# Altium project HAB-Main-Flight-Computer-Card-Template.PrjPcb (part 3 of 4)

## Sheet ComputeModule.SchDoc: Main Flight Computer Processor
size A2; Organization: Brickworks; Address1: Matthew Glazer; Address2: Design Engineer; Revision: 1A; SheetNumber: 5; SheetTotal: 7
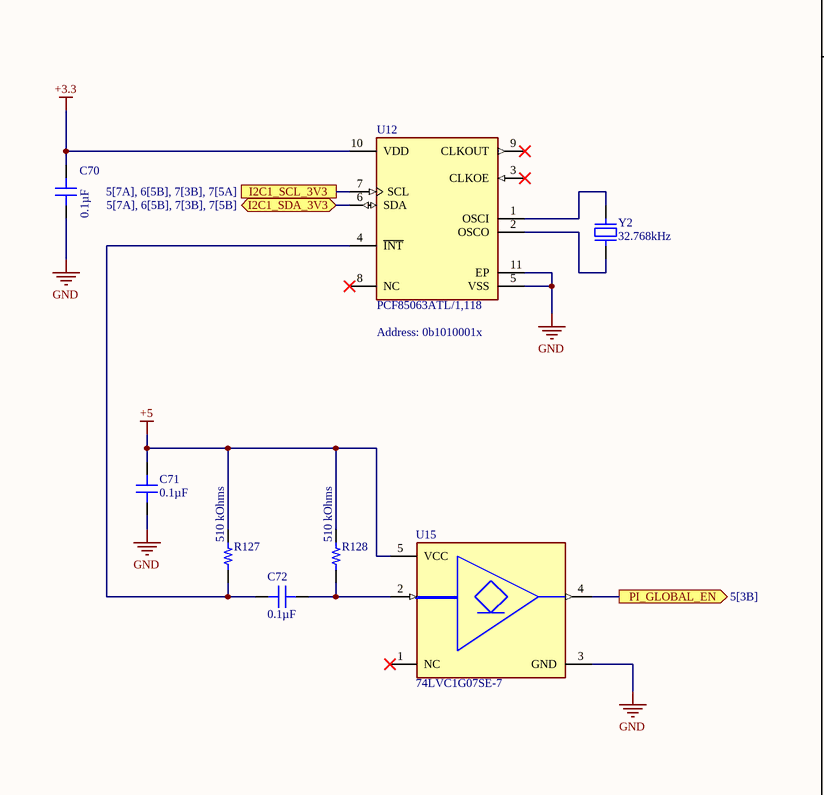
[diagram p5: ComputeModule.SchDoc, left]
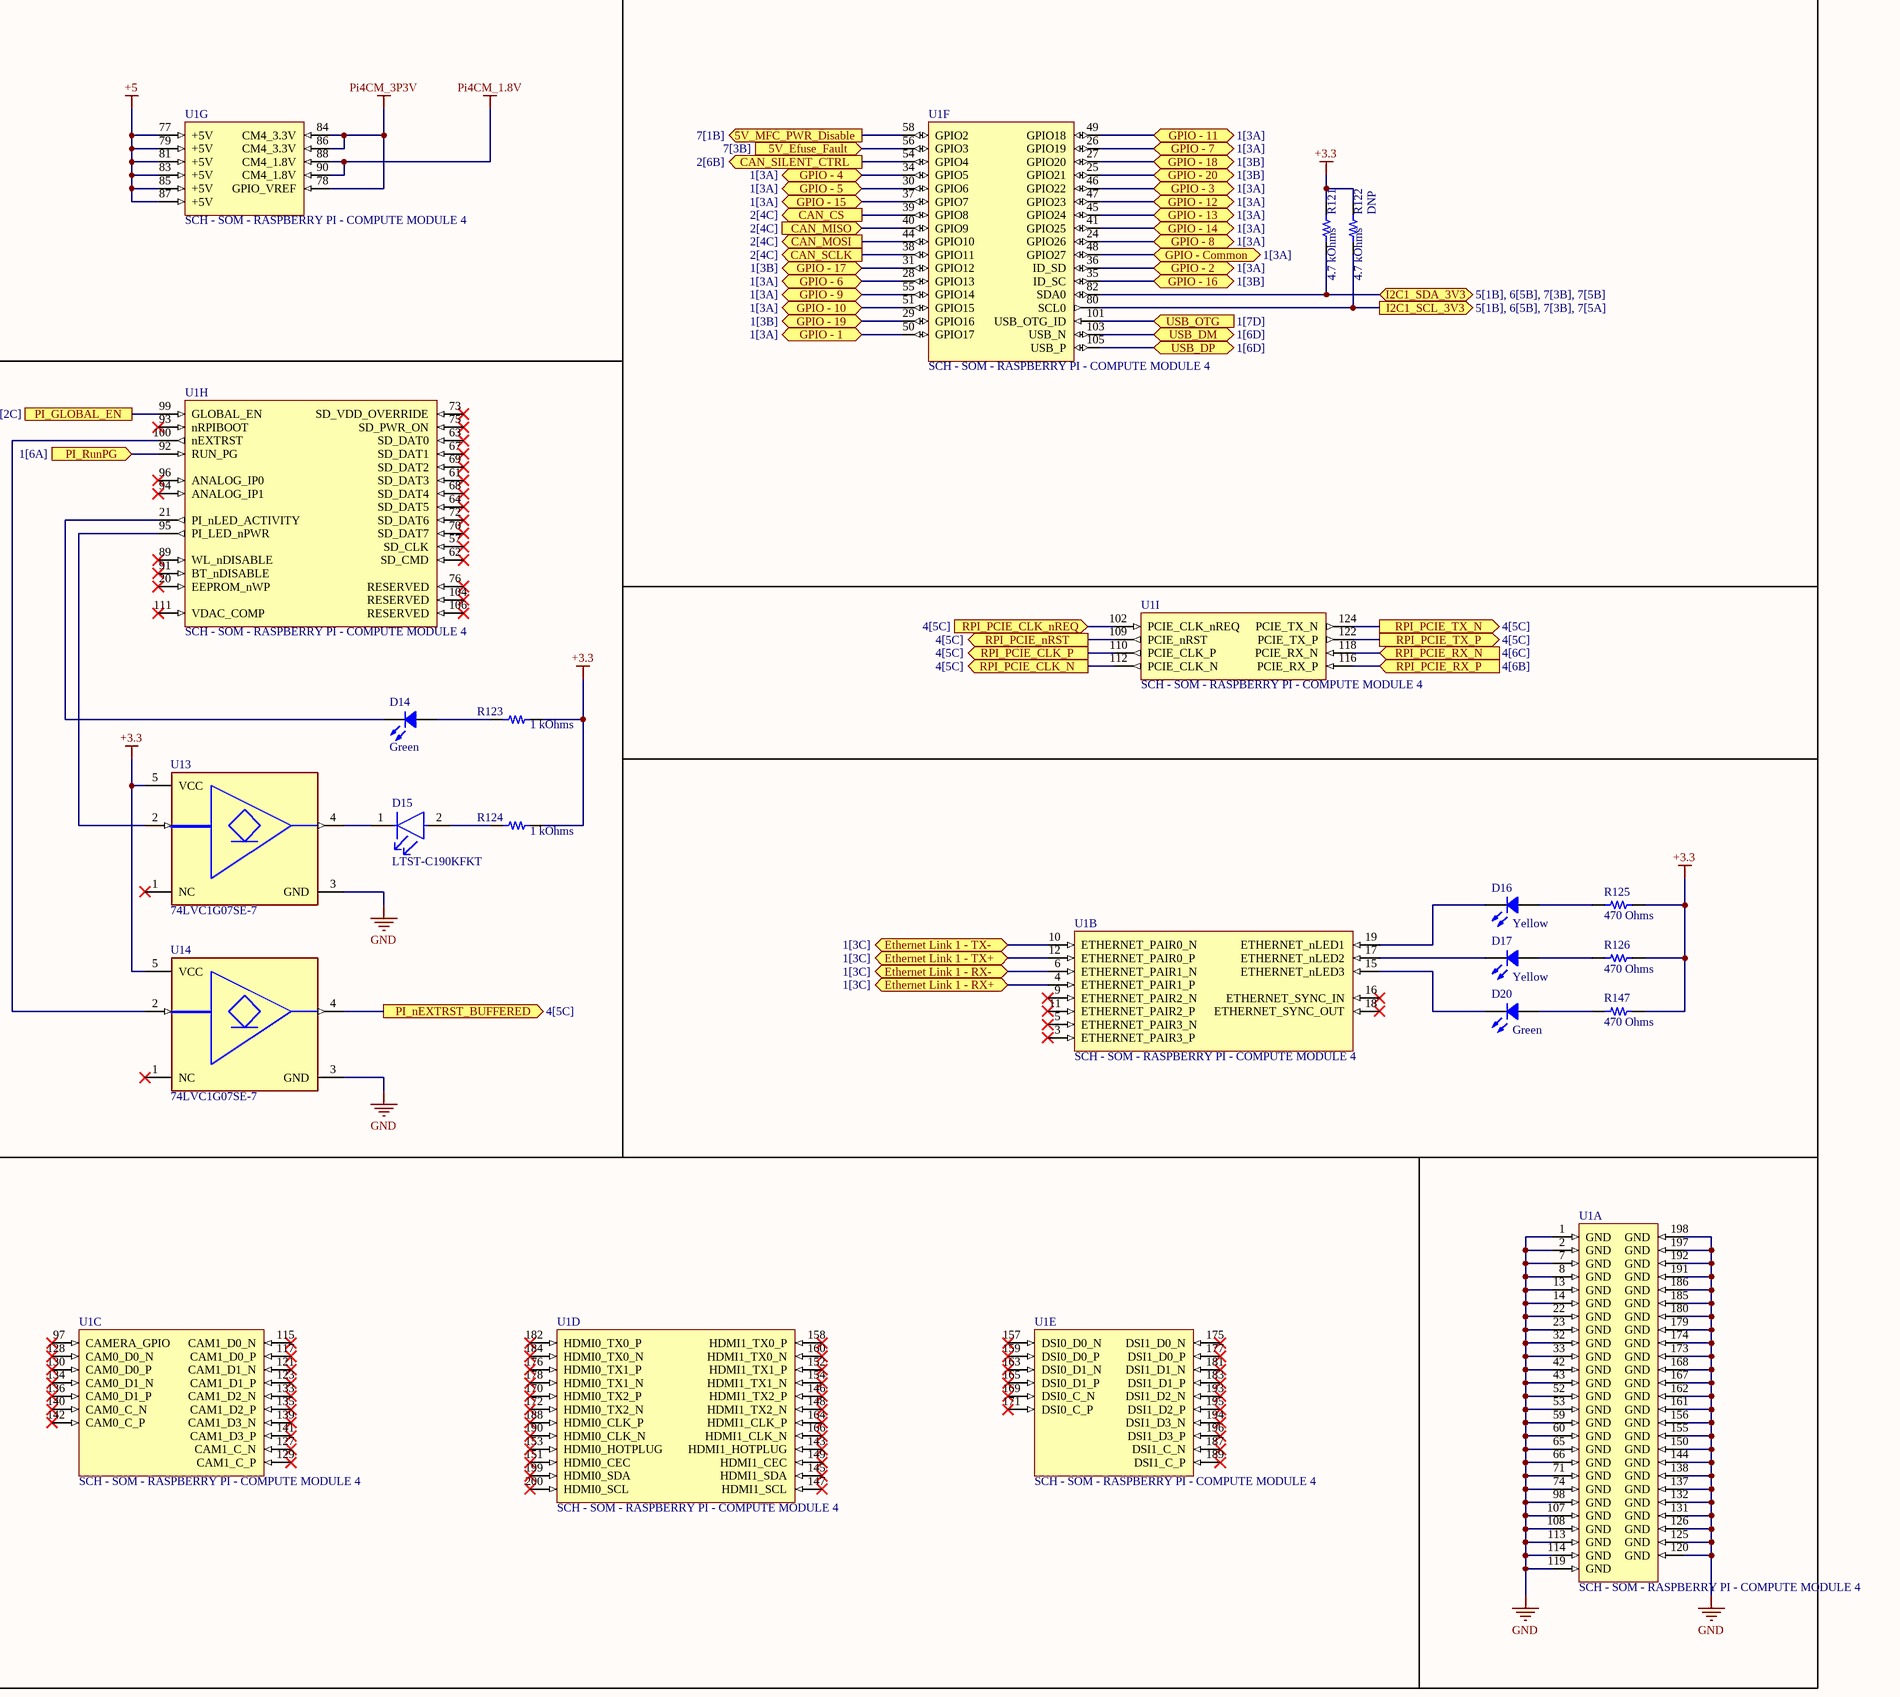
[diagram p6: ComputeModule.SchDoc, right]

### Parts
C70  0.1µF  [CAP 0603_1608]
C71  0.1µF  [CAP 0603_1608]
C72  0.1µF  [CAP 0603_1608]
D14  Green  [LED 0603_1608 GREEN]
D15  LTST-C190KFKT  [FP-LTST-C190KFKT-MFG]
D16  Yellow  [LED 0603_1608 YELLOW]
D17  Yellow  [LED 0603_1608 YELLOW]
D20  Green  [LED 0603_1608 GREEN]
R121  4.7 kOhms  [RES 0603_1608]
R122  4.7 kOhms  [RES 0603_1608]
R123  1 kOhms  [RES 0603_1608]
R124  1 kOhms  [RES 0603_1608]
R125  470 Ohms  [RES 0603_1608]
R126  470 Ohms  [RES 0603_1608]
R127  510 kOhms  [RES 0603_1608]
R128  510 kOhms  [RES 0603_1608]
R147  470 Ohms  [RES 0603_1608]
U1  SCH - SOM - RASPBERRY PI - COMPUTE MODULE 4  [PCB - SOM - Pi4 Compute Module]  (parts A,B,C,D,E,F,G,H,I of 9)
U12  PCF85063ATL/1,118  [FP-SOT1197-1-MFG]
U13  74LVC1G07SE-7  [FP-SOT353-MFG]
U14  74LVC1G07SE-7  [FP-SOT353-MFG]
U15  74LVC1G07SE-7  [FP-SOT353-MFG]
Y2  32.768kHz  [ABRACON ABS07]

### Ports
5V_Efuse_Fault (in, see 7[3B]), 5V_MFC_PWR_Disable (out, see 7[1B]), CAN_CS (out, see 2[4C]), CAN_MISO (in, see 2[4C]), CAN_MOSI (out, see 2[4C]), CAN_SCLK (out, see 2[4C]), CAN_SILENT_CTRL (out, see 2[6B]), Ethernet Link 1 - RX+ (bidir, see 1[3C]), Ethernet Link 1 - RX- (bidir, see 1[3C]), Ethernet Link 1 - TX+ (bidir, see 1[3C]), Ethernet Link 1 - TX- (bidir, see 1[3C]), GPIO - 1 (bidir, see 1[3A]), GPIO - 2 (bidir, see 1[3A]), GPIO - 3 (bidir, see 1[3A]), GPIO - 4 (bidir, see 1[3A]), GPIO - 5 (bidir, see 1[3A]), GPIO - 6 (bidir, see 1[3A]), GPIO - 7 (bidir, see 1[3A]), GPIO - 8 (bidir, see 1[3A]), GPIO - 9 (bidir, see 1[3A]), GPIO - 10 (bidir, see 1[3A]), GPIO - 11 (bidir, see 1[3A]), GPIO - 12 (bidir, see 1[3A]), GPIO - 13 (bidir, see 1[3A]), GPIO - 14 (bidir, see 1[3A]), GPIO - 15 (bidir, see 1[3A]), GPIO - 16 (bidir, see 1[3B]), GPIO - 17 (bidir, see 1[3B]), GPIO - 18 (bidir, see 1[3B]), GPIO - 19 (bidir, see 1[3B]), GPIO - 20 (bidir, see 1[3B]), GPIO - Common (bidir, see 1[3A]), I2C1_SCL_3V3 (out, see 5[1B], 6[5B], 7[3B], 7[5A]), I2C1_SCL_3V3 (see 5[7A], 6[5B], 7[3B], 7[5A]), I2C1_SDA_3V3 (bidir, see 5[1B], 6[5B], 7[3B], 7[5B]), I2C1_SDA_3V3 (bidir, see 5[7A], 6[5B], 7[3B], 7[5B]), PI_GLOBAL_EN (out, see 5[3B]), PI_GLOBAL_EN (see 5[2C]), PI_nEXTRST_BUFFERED (out, see 4[5C]), PI_RunPG (in, see 1[6A]), RPI_PCIE_CLK_N (out, see 4[5C]), RPI_PCIE_CLK_nREQ (in, see 4[5C]), RPI_PCIE_CLK_P (out, see 4[5C]), RPI_PCIE_nRST (out, see 4[5C]), RPI_PCIE_RX_N (in, see 4[6C]), RPI_PCIE_RX_P (in, see 4[6B]), RPI_PCIE_TX_N (out, see 4[5C]), RPI_PCIE_TX_P (out, see 4[5C]), USB_DM (bidir, see 1[6D]), USB_DP (bidir, see 1[6D]), USB_OTG (in, see 1[7D])

### Nets
+3.3: C70.2 R121.2 R122.2 R123.1 R124.1 R125.2 R126.2 R147.2 U12.10(VDD) U13.5(VCC) U14.5(VCC)
+5: C71.1 R127.2 R128.2 U1.77(+5V) U1.79(+5V) U1.81(+5V) U1.83(+5V) U1.85(+5V) U1.87(+5V) U15.5(VCC)
GND: C70.1 C71.2 U1.1(GND) U1.2(GND) U1.7(GND) U1.8(GND) U1.13(GND) U1.14(GND) U1.22(GND) U1.23(GND) U1.32(GND) U1.33(GND) U1.42(GND) U1.43(GND) U1.52(GND) U1.53(GND) U1.59(GND) U1.60(GND) U1.65(GND) U1.66(GND) U1.71(GND) U1.74(GND) U1.98(GND) U1.107(GND) U1.108(GND) U1.113(GND) U1.114(GND) U1.119(GND) U1.120(GND) U1.125(GND) U1.126(GND) U1.131(GND) U1.132(GND) U1.137(GND) U1.138(GND) U1.144(GND) U1.150(GND) U1.155(GND) U1.156(GND) U1.161(GND) U1.162(GND) U1.167(GND) U1.168(GND) U1.173(GND) U1.174(GND) U1.179(GND) U1.180(GND) U1.185(GND) U1.186(GND) U1.191(GND) U1.192(GND) U1.197(GND) U1.198(GND) U12.5(VSS) U12.11(EP) U13.3(GND) U14.3(GND) U15.3(GND)
Pi4CM_1.8V: U1.88(CM4_1.8V) U1.90(CM4_1.8V)
Pi4CM_3P3V: U1.78(GPIO_VREF) U1.84(CM4_3.3V) U1.86(CM4_3.3V)
ETH1_RX_N: U1.6(ETHERNET_PAIR1_N) ; port Ethernet Link 1 - RX-
ETH1_RX_P: U1.4(ETHERNET_PAIR1_P) ; port Ethernet Link 1 - RX+
ETH1_TX_N: U1.10(ETHERNET_PAIR0_N) ; port Ethernet Link 1 - TX-
ETH1_TX_P: U1.12(ETHERNET_PAIR0_P) ; port Ethernet Link 1 - TX+
NetC5_1: U1.116(PCIE_RX_P) ; port RPI_PCIE_RX_P
NetC6_1: U1.118(PCIE_RX_N) ; port RPI_PCIE_RX_N
NetC72_1: C72.1 R128.1 U15.2(A)
NetC72_2: C72.2 R127.1 U12.4(~{INT})
NetD14_1: D14.1 R123.2
NetD14_2: D14.2 U1.21(PI_nLED_ACTIVITY)
NetD15_1: D15.1(C) U13.4(Y)
NetD15_2: D15.2(A) R124.2
NetD16_1: D16.1 R125.1
NetD16_2: D16.2 U1.19(ETHERNET_nLED1)
NetD17_1: D17.1 R126.1
NetD17_2: D17.2 U1.17(ETHERNET_nLED2)
NetD20_1: D20.1 R147.1
NetD20_2: D20.2 U1.15(ETHERNET_nLED3)
NetJ1_13: U1.48(GPIO27) ; port GPIO - Common
NetJ1_14: U1.50(GPIO17) ; port GPIO - 1
NetJ1_15: U1.36(ID_SD) ; port GPIO - 2
NetJ1_16: U1.46(GPIO22) ; port GPIO - 3
NetJ1_17: U1.30(GPIO6) ; port GPIO - 5
NetJ1_18: U1.34(GPIO5) ; port GPIO - 4
NetJ1_19: U1.26(GPIO19) ; port GPIO - 7
NetJ1_20: U1.28(GPIO13) ; port GPIO - 6
NetJ1_21: U1.55(GPIO14) ; port GPIO - 9
NetJ1_22: U1.24(GPIO26) ; port GPIO - 8
NetJ1_23: U1.49(GPIO18) ; port GPIO - 11
NetJ1_24: U1.51(GPIO15) ; port GPIO - 10
NetJ1_25: U1.45(GPIO24) ; port GPIO - 13
NetJ1_26: U1.47(GPIO23) ; port GPIO - 12
NetJ1_27: U1.37(GPIO7) ; port GPIO - 15
NetJ1_28: U1.41(GPIO25) ; port GPIO - 14
NetJ1_29: U1.31(GPIO12) ; port GPIO - 17
NetJ1_30: U1.35(ID_SC) ; port GPIO - 16
NetJ1_31: U1.27(GPIO20) ; port GPIO - 18
NetJ1_32: U1.29(GPIO16) ; port GPIO - 19
NetJ1_33: U1.25(GPIO21) ; port GPIO - 20
NetJ3_1: U1.92(RUN_PG) ; port PI_RunPG
NetR44_1: U1.101(USB_OTG_ID) ; port USB_OTG
NetR48_2: U1.54(GPIO4) ; port CAN_SILENT_CTRL
NetR95_1: U1.56(GPIO3) ; port 5V_Efuse_Fault
NetR106_2: U1.58(GPIO2) ; port 5V_MFC_PWR_Disable
NetR121_1: R121.1 U1.82(SDA0) U12.6(SDA) ; port I2C1_SDA_3V3
NetR122_1: R122.1 U1.80(SCL0) U12.7(SCL) ; port I2C1_SCL_3V3
NetR135_1: U14.4(Y) ; port PI_nEXTRST_BUFFERED
NetU1_38: U1.38(GPIO11) ; port CAN_SCLK
NetU1_39: U1.39(GPIO8) ; port CAN_CS
NetU1_40: U1.40(GPIO9) ; port CAN_MISO
NetU1_44: U1.44(GPIO10) ; port CAN_MOSI
NetU1_95: U1.95(PI_LED_nPWR) U13.2(A)
NetU1_99: U1.99(GLOBAL_EN) U15.4(Y) ; port PI_GLOBAL_EN
NetU1_100: U1.100(nEXTRST) U14.2(A)
NetU1_102: U1.102(PCIE_CLK_nREQ) ; port RPI_PCIE_CLK_nREQ
NetU1_103: U1.103(USB_N) ; port USB_DM
NetU1_105: U1.105(USB_P) ; port USB_DP
NetU1_109: U1.109(PCIE_nRST) ; port RPI_PCIE_nRST
NetU1_110: U1.110(PCIE_CLK_P) ; port RPI_PCIE_CLK_P
NetU1_112: U1.112(PCIE_CLK_N) ; port RPI_PCIE_CLK_N
NetU1_122: U1.122(PCIE_TX_P) ; port RPI_PCIE_TX_P
NetU1_124: U1.124(PCIE_TX_N) ; port RPI_PCIE_TX_N
NetU12_1: U12.1(OSCI) Y2.2
NetU12_2: U12.2(OSCO) Y2.1

Not connected (* = marked no-connect by the designer): U1 3(ETHERNET_PAIR3_P)* 5(ETHERNET_PAIR3_N)* 9(ETHERNET_PAIR2_N)* 11(ETHERNET_PAIR2_P)* 16(ETHERNET_SYNC_IN)* 18(ETHERNET_SYNC_OUT)* 20(EEPROM_nWP)* 57(SD_CLK)* 61(SD_DAT3)* 62(SD_CMD)* 63(SD_DAT0)* 64(SD_DAT5)* 67(SD_DAT1)* 68(SD_DAT4)* 69(SD_DAT2)* 70(SD_DAT7)* 72(SD_DAT6)* 73(SD_VDD_OVERRIDE)* 75(SD_PWR_ON)* 76(RESERVED)* 89(WL_nDISABLE)* 91(BT_nDISABLE)* 93(nRPIBOOT)* 94(ANALOG_IP1)* 96(ANALOG_IP0)* 97(CAMERA_GPIO)* 104(RESERVED)* 106(RESERVED)* 111(VDAC_COMP)* 115(CAM1_D0_N)* 117(CAM1_D0_P)* 121(CAM1_D1_N)* 123(CAM1_D1_P)* 127(CAM1_C_N)* 128(CAM0_D0_N)* 129(CAM1_C_P)* 130(CAM0_D0_P)* 133(CAM1_D2_N)* 134(CAM0_D1_N)* 135(CAM1_D2_P)* 136(CAM0_D1_P)* 139(CAM1_D3_N)* 140(CAM0_C_N)* 141(CAM1_D3_P)* 142(CAM0_C_P)* 143(HDMI1_HOTPLUG)* 145(HDMI1_SDA)* 146(HDMI1_TX2_P)* 147(HDMI1_SCL)* 148(HDMI1_TX2_N)* 149(HDMI1_CEC)* 151(HDMI0_CEC)* 152(HDMI1_TX1_P)* 153(HDMI0_HOTPLUG)* 154(HDMI1_TX1_N)* 157(DSI0_D0_N)* 158(HDMI1_TX0_P)* 159(DSI0_D0_P)* 160(HDMI1_TX0_N)* 163(DSI0_D1_N)* 164(HDMI1_CLK_P)* 165(DSI0_D1_P)* 166(HDMI1_CLK_N)* 169(DSI0_C_N)* 170(HDMI0_TX2_P)* 171(DSI0_C_P)* 172(HDMI0_TX2_N)* 175(DSI1_D0_N)* 176(HDMI0_TX1_P)* 177(DSI1_D0_P)* 178(HDMI0_TX1_N)* 181(DSI1_D1_N)* 182(HDMI0_TX0_P)* 183(DSI1_D1_P)* 184(HDMI0_TX0_N)* 187(DSI1_C_N)* 188(HDMI0_CLK_P)* 189(DSI1_C_P)* 190(HDMI0_CLK_N)* 193(DSI1_D2_N)* 194(DSI1_D3_N)* 195(DSI1_D2_P)* 196(DSI1_D3_P)* 199(HDMI0_SDA)* 200(HDMI0_SCL)*; U12 3(CLKOE)* 8(NC)* 9(CLKOUT)*; U13 1(NC)*; U14 1(NC)*; U15 1(NC)*

### Notes on the sheet
- (near R122) DNP
- (near U12) Address: 0b1010001x
- Title
- Size:
- Date:
- File:
- A2
- Number:
- Time:
- Revision:
- Sheet
- of

### Library data of the parts
C70-C72 = CL10B104KA8WPNC: CAP CER 0.1UF 25V X7R 0603; Manufacturer: Samsung Electro-Mechanics; Tolerance: ±10%; Part Number: CL10B104KA8WPNC; Value: 0.1µF; Applications: Automotive; Capacitance: 0.1µF; ComponentLink1Description: Datasheet; ComponentLink1URL: http://www.samsungsem.com/kr/support/product-search/mlcc/CL10B104KA8WPNC.jsp; ComponentLink2Description: DigiKey Link; ComponentLink2URL: http://digikey.com/product-detail/en/samsung-electro-mechanics/CL10B104KA8WPNC/1276-6717-1-ND/5961576; Device Package: 0603 (1608 Metric); Features: Open Mode; LastUpdated: 9/2/2020 1:03:30 AM; Lifecycle Status: Active; Minimum Order: 1; Mounting Type: Surface Mount, MLCC; Operating Temperature: -55°C ~ 125°C; Package / Case: 0603 (1608 Metric); Packaging: TapeAndReel; PartId: 5631; Part Status: Active; Price: 0.02; Ratings: AEC-Q200; Series: CL; Size / Dimension: 0.063" L x 0.031" W (1.60mm x 0.80mm); Supplier 1: DigiKey; Supplier Part Number 1: 1276-6717-1-ND; Temperature Coefficient: X7R; Thickness (Max): 0.035" (0.90mm); Voltage - Rated: 25V
D14 D20 = LTST-C193KGKT-5A: LED GREEN CLEAR CHIP SMD; Manufacturer: Lite-On Inc.; Configuration: Standard; Current - Test: 5mA; Lens Color: Colorless; Lens Size: 1.15mm x 0.80mm; Lens Style: Rectangle with Flat Top; Millicandela Rating: 16.25mcd; Viewing Angle: 130°; Voltage - Forward (Vf) (Typ): 2V; Wavelength - Dominant: 572nm; Wavelength - Peak: 574nm; Part Number: LTST-C193KGKT-5A; Color: Green; ComponentLink1Description: Datasheet; ComponentLink1URL: http://optoelectronics.liteon.com/upload/download/DS22-2007-0094/LTST-C193KGKT-5A.PDF; ComponentLink2Description: DigiKey Link; ComponentLink2URL: http://digikey.com/product-detail/en/lite-on-inc/LTST-C193KGKT-5A/160-1828-1-ND/2356247; Device Package: 0603 (1608 Metric); Height (Max): 0.45mm; LastUpdated: 9/2/2020 1:20:41 AM; Lens Transparency: Clear; Lifecycle Status: Active; Minimum Order: 1; Mounting Type: Surface Mount; Package / Case: 0603 (1608 Metric); Packaging: TapeAndReel; PartId: 694; Part Status: Active; Price: 0.06; Series: -; Size / Dimension: 1.60mm L x 0.80mm W; Supplier 1: DigiKey; Supplier Part Number 1: 160-1828-1-ND; Supplier Device Package: Chip LED; Value: Green
D15 = CMP-1674-00008-2: LED ORANGE CLEAR CHIP SMD; Number of LEDs: 1; Reverse Voltage: 5V; Power Rating: 75mW; Lens Style: Diffused; Wavelength: 611nm; Forward Voltage: 2V; Test Current: 20mA; Lens Color: Colorless; Dominant Wavelength: 605nm; Forward Current: 30mA; Viewing Angle: 130°; Luminous Intensity: 90mcd; Depth: 1.6mm; Length: 3.2mm; Width: 0.8mm; Lead Free: Lead Free; Height: 0.8mm; Radiation Hardening: No; Max Operating Temperature: 85°C; Illumination Color: Orange; Power Dissipation: 75mW; Packaging: Tape and Reel; Lens Transparency: Clear; Min Operating Temperature: -55°C; Package Quantity: 1; Case Code (Metric): 1608; Number of Pins: 2; Case Code (Imperial): 0603; Case/Package: 0603; Number of Elements: 1; Color: Orange; Mount: Surface Mount
D16 D17 = LTST-C191KSKT: LED YELLOW CLEAR SMD; Manufacturer: Lite-On Inc.; Configuration: Standard; Current - Test: 20mA; Lens Color: Colorless; Lens Size: 1.10mm x 0.80mm; Lens Style: Rectangle with Flat Top; Millicandela Rating: 104mcd; Viewing Angle: 130°; Voltage - Forward (Vf) (Typ): 2.1V; Wavelength - Dominant: 591nm; Wavelength - Peak: 588nm; Part Number: LTST-C191KSKT; Color: Yellow; ComponentLink1Description: Datasheet; ComponentLink1URL: http://optoelectronics.liteon.com/upload/download/DS22-2000-224/LTST-C191KSKT.PDF; ComponentLink2Description: DigiKey Link; ComponentLink2URL: http://digikey.com/product-detail/en/lite-on-inc/LTST-C191KSKT/160-1448-1-ND/386838; Device Package: 0603 (1608 Metric); Height (Max): 0.65mm; LastUpdated: 9/2/2020 1:21:17 AM; Lens Transparency: Clear; Lifecycle Status: Active; Minimum Order: 1; Mounting Type: Surface Mount; Package / Case: 0603 (1608 Metric); Packaging: TapeAndReel; PartId: 132; Part Status: Active; Price: 0.04; Series: -; Size / Dimension: 1.60mm L x 0.80mm W; Supplier 1: DigiKey; Supplier Part Number 1: 160-1448-1-ND; Value: Yellow
R121 R122 = RMCF0603FT4K70: RES 4.7K OHM 1% 1/10W 0603; Manufacturer: Stackpole Electronics Inc; Power (Watts): 0.1W, 1/10W; Temperature Coefficient: ±100ppm/°C; Part Number: RMCF0603FT4K70; Value: 4.7 kOhms; ComponentLink1Description: Datasheet; ComponentLink1URL: https://www.seielect.com/catalog/sei-rmcf_rmcp.pdf; ComponentLink2Description: DigiKey Link; ComponentLink2URL: http://digikey.com/product-detail/en/stackpole-electronics-inc/RMCF0603FT4K70/RMCF0603FT4K70CT-ND/1943033; Composition: Thick Film; Device Package: 0603 (1608 Metric); Features: Automotive AEC-Q200; Height - Seated (Max): 0.022" (0.55mm); LastUpdated: 9/2/2020 1:10:22 AM; Lifecycle Status: Active; Minimum Order: 1; Number of Terminations: 2; Operating Temperature: -55°C ~ 155°C; Package / Case: 0603 (1608 Metric); Packaging: CutTape; PartId: 6078; Part Status: Active; Price: 0.10; Ratings: AEC-Q200; Resistance: 4.7 kOhms; Series: RMCF; Size / Dimension: 0.061" L x 0.031" W (1.55mm x 0.80mm); Supplier 1: DigiKey; Supplier Part Number 1: RMCF0603FT4K70CT-ND; Supplier Device Package: 0603; Tolerance: ±1%
R123 R124 = RNCP0603FTD1K00: RES 1K OHM 1% 1/8W 0603; Manufacturer: Stackpole Electronics Inc; Power (Watts): 0.125W, 1/8W; Temperature Coefficient: ±100ppm/°C; Part Number: RNCP0603FTD1K00; Value: 1 kOhms; ComponentLink1Description: Datasheet; ComponentLink1URL: https://www.seielect.com/catalog/sei-rncp.pdf; ComponentLink2Description: DigiKey Link; ComponentLink2URL: http://digikey.com/product-detail/en/stackpole-electronics-inc/RNCP0603FTD1K00/RNCP0603FTD1K00CT-ND/2240445; Composition: Thin Film; Device Package: 0603 (1608 Metric); Features: Anti-Sulfur, Moisture Resistant; Height - Seated (Max): 0.020" (0.50mm); LastUpdated: 9/2/2020 1:10:23 AM; Lifecycle Status: Active; Minimum Order: 1; Number of Terminations: 2; Operating Temperature: -55°C ~ 155°C; Package / Case: 0603 (1608 Metric); Packaging: TapeAndReel; PartId: 5694; Part Status: Active; Price: 0.01; Resistance: 1 kOhms; Series: RNCP; Size / Dimension: 0.059" L x 0.031" W (1.50mm x 0.80mm); Supplier 1: DigiKey; Supplier Part Number 1: RNCP0603FTD1K00CT-ND; Supplier Device Package: 0603; Tolerance: ±1%
R125 R126 R147 = RMCF0603JT470R: RES 470 OHM 5% 1/10W 0603; Manufacturer: Stackpole Electronics Inc; Power (Watts): 0.1W, 1/10W; Temperature Coefficient: ±200ppm/°C; Part Number: RMCF0603JT470R; Value: 470 Ohms; ComponentLink1Description: Datasheet; ComponentLink1URL: https://www.seielect.com/catalog/sei-rmcf_rmcp.pdf; ComponentLink2Description: DigiKey Link; ComponentLink2URL: http://digikey.com/product-detail/en/stackpole-electronics-inc/RMCF0603JT470R/RMCF0603JT470RCT-ND/1943166; Composition: Thick Film; Device Package: 0603 (1608 Metric); Features: Automotive AEC-Q200; Height - Seated (Max): 0.022" (0.55mm); LastUpdated: 9/2/2020 1:10:23 AM; Lifecycle Status: Active; Minimum Order: 1; Number of Terminations: 2; Operating Temperature: -55°C ~ 155°C; Package / Case: 0603 (1608 Metric); Packaging: CutTape; PartId: 5857; Part Status: Active; Price: 0.10; Ratings: AEC-Q200; Resistance: 470 Ohms; Series: RMCF; Size / Dimension: 0.061" L x 0.031" W (1.55mm x 0.80mm); Supplier 1: DigiKey; Supplier Part Number 1: RMCF0603JT470RCT-ND; Supplier Device Package: 0603; Tolerance: ±5%
R127 R128 = RMCF0603JT510K: RES 510K OHM 5% 1/10W 0603; Manufacturer: Stackpole Electronics Inc; Power (Watts): 0.1W, 1/10W; Temperature Coefficient: ±200ppm/°C; Part Number: RMCF0603JT510K; Value: 510 kOhms; ComponentLink1Description: Datasheet; ComponentLink1URL: https://www.seielect.com/catalog/sei-rmcf_rmcp.pdf; ComponentLink2Description: DigiKey Link; ComponentLink2URL: http://digikey.com/product-detail/en/stackpole-electronics-inc/RMCF0603JT510K/RMCF0603JT510KCT-ND/6053186; Composition: Thick Film; Device Package: 0603 (1608 Metric); Features: Automotive AEC-Q200; Height - Seated (Max): 0.022" (0.55mm); LastUpdated: 9/2/2020 1:10:01 AM; Lifecycle Status: Active; Minimum Order: 1; Number of Terminations: 2; Operating Temperature: -55°C ~ 155°C; Package / Case: 0603 (1608 Metric); Packaging: CutTape; PartId: 15991; Part Status: Active; Price: 0.10; Ratings: AEC-Q200; Resistance: 510 kOhms; Series: RMCF; Size / Dimension: 0.061" L x 0.031" W (1.55mm x 0.80mm); Supplier 1: DigiKey; Supplier Part Number 1: RMCF0603JT510KCT-ND; Supplier Device Package: 0603; Tolerance: ±5%
U12 = CMP-10083-000009-1: IC RTC CLK/CALENDAR I2C 10-SON; Manufacturer: NXP Semiconductors; Frequency: 0.001/1.024/2.048/4.096/8.192/16.384/32.768kHz; Nominal Supply Current: 18uA; Min Supply Voltage: 0.9V; Number Of Outputs: 1; Standoff Height: 0mm; Max Supply Voltage: 5.5V; RoHS: TRUE; Manufacturer Part Number: PCF85063ATL/1,118; Octopart: https://octopart.com/pcf85063atl%2F1%2C118-nxp+semiconductors-27552710; Device Class L3: Real Time Clocks; Height: 0.5mm; Lead Free: Yes; Ipc Land Pattern Name: DFN260X260X50-10; Temperature Range Low: -40°C; Interface: I2C; ComponentLink2URL: https://www.nxp.com/docs/en/data-sheet/PCF85063A.pdf; Mouser Description: Tiny Real-Time Clock/calendar With Alarm Function And I2C-Bus Rohs Compliant: Yes; Package: SOT1197-1; Category: IC; Ambient Temperature Range Low: -40°C; Temperature: -40°C to +85°C; ComponentLink2Description: Datasheet; Ambient Temperature Range High: +85°C; Automotive: No; Temperature Range High: +85°C; Digikey Description: IC RTC CLK/CALENDAR I2C 10-SON; Device Class L1: Integrated Circuits (ICs); Footprint Url: https://www.nxp.com/docs/en/package-information/SOT1197-1.pdf; Device Class L2: Clock and Timing
U13-U15 = CMP-12739-000001-1: IC BUF NON-INVERT 5.5V SOT353; Manufacturer: Diodes Inc.; Number Of Outputs: 1; Standoff Height: 0mm; Propagation Delay: 1.7ns; Nominal Supply Current: 0.1uA; Min Supply Voltage: 1.65V; Max Junction Temp: +150°C; Logic Function Desc: Non-Inverting; Temperature: -40°C to +125°C; RoHS: TRUE; ComponentLink2Description: Datasheet; Category: IC; Ipc Land Pattern Name: SOT65P210X100-5; Digikey Description: IC BUF NON-INVERT 5.5V SOT353; Device Class L2: Logic ICs; Number Of Inputs: 1; Height: 1.1mm; Ambient Temperature Range High: +125°C; Lead Free: Yes; Octopart: https://octopart.com/74lvc1g07se-7-diodes+inc.-18882698; Device Class L1: Integrated Circuits (ICs); Number Of Circuits: 1; Max Supply Voltage: 5.5V; Temperature Range Low: -40°C; Manufacturer Part Number: 74LVC1G07SE-7; Device Class L3: Buffers; ComponentLink2URL: https://www.diodes.com/assets/Datasheets/74LVC1G07.pdf; Footprint Url: https://www.diodes.com/assets/Package-Files/SOT353.pdf; Temperature Range High: +125°C; Package: SOT353; Mouser Description: 74LVC Series 5.5 V Surface Mount Single Buffer with Open Drain Output - SOT-353; Automotive: No; Ambient Temperature Range Low: -40°C
Y2 = ABS07-166-32.768KHZ-T: IOT 32.786KHZ XTAL; Manufacturer: Abracon LLC; ESR (Equivalent Series Resistance): 70 kOhms; Frequency Tolerance: ±10ppm; Load Capacitance: 7pF; Operating Mode: Fundamental; Part Number: ABS07-166-32.768KHZ-T; ComponentLink1Description: Datasheet; ComponentLink1URL: https://abracon.com/datasheets/ABS07-166-32.768kHz-T.pdf; ComponentLink2Description: DigiKey Link; ComponentLink2URL: http://digikey.com/product-detail/en/abracon-llc/ABS07-166-32.768KHZ-T/535-14514-1-ND/8827205; Frequency: 32.768kHz; Height - Seated (Max): 0.035" (0.90mm); LastUpdated: 9/2/2020 1:21:47 AM; Lifecycle Status: Active; Minimum Order: 1; Mounting Type: Surface Mount; Operating Temperature: -40°C ~ 85°C; Package / Case: 2-SMD, No Lead; Packaging: TapeAndReel; PartId: 384; Part Status: Active; Price: 0.35; Series: ABS07; Size / Dimension: 0.126" L x 0.059" W (3.20mm x 1.50mm); Supplier 1: DigiKey; Supplier Part Number 1: 535-14514-1-ND; Type: kHz Crystal (Tuning Fork); Value: 32.768kHz

## Sheet Sensors.SchDoc: Main Flight Computer Sensors
size A3; Organization: Brickworks; Address1: Matthew Glazer; Address2: Design Engineer; Revision: 1A; SheetNumber: 6; SheetTotal: 7
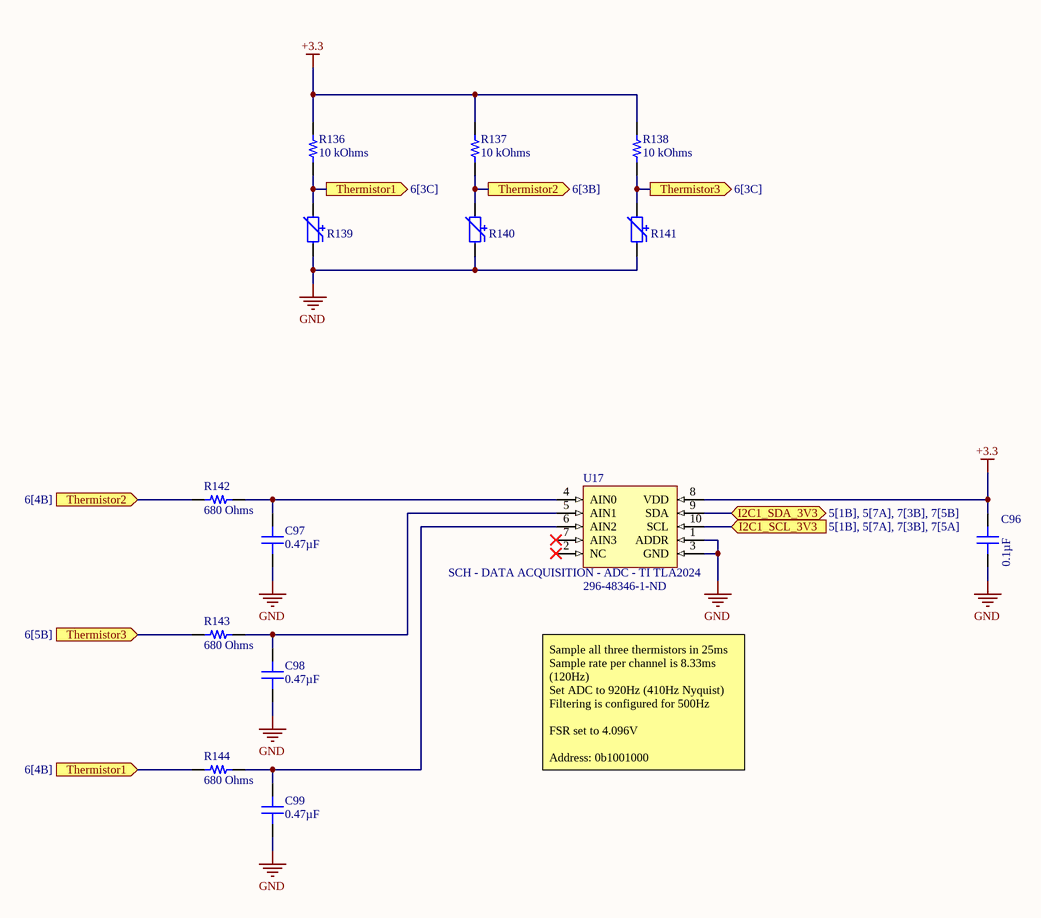
[diagram p7: Sensors.SchDoc]

### Parts
C96  0.1µF  [CAP 0603_1608]
C97  0.47µF  [CAP 0603_1608]
C98  0.47µF  [CAP 0603_1608]
C99  0.47µF  [CAP 0603_1608]
R136  10 kOhms  [RES 0603_1608]
R137  10 kOhms  [RES 0603_1608]
R138  10 kOhms  [RES 0603_1608]
R139  10 kOhms  [PTC 0402_1005]  (value not drawn)
R140  10 kOhms  [PTC 0402_1005]  (value not drawn)
R141  10 kOhms  [PTC 0402_1005]  (value not drawn)
R142  680 Ohms  [RES 0603_1608]
R143  680 Ohms  [RES 0603_1608]
R144  680 Ohms  [RES 0603_1608]
U17  SCH - DATA ACQUISITION - ADC - TI TLA2024  Supplier Part Number 1: 296-48346-1-ND  [PCB - LEADLESS - QFN - TI X2QFN-10]

### Ports
I2C1_SCL_3V3 (in, see 5[1B], 5[7A], 7[3B], 7[5A]), I2C1_SDA_3V3 (bidir, see 5[1B], 5[7A], 7[3B], 7[5B]), Thermistor1 (in, see 6[4B]), Thermistor1 (out, see 6[3C]), Thermistor2 (in, see 6[4B]), Thermistor2 (out, see 6[3B]), Thermistor3 (in, see 6[5B]), Thermistor3 (out, see 6[3C])

### Nets
+3.3: C96.2 R136.2 R137.2 R138.2 U17.8(VDD)
GND: C96.1 C97.1 C98.1 C99.1 R139.1 R140.1 R141.1 U17.1(ADDR) U17.3(GND)
NetC97_2: C97.2 R142.2 U17.4(AIN0)
NetC98_2: C98.2 R143.2 U17.5(AIN1)
NetC99_2: C99.2 R144.2 U17.6(AIN2)
NetR121_1: U17.9(SDA) ; port I2C1_SDA_3V3
NetR122_1: U17.10(SCL) ; port I2C1_SCL_3V3
NetR136_1: R136.1 R139.2 R144.1 ; port Thermistor1
NetR137_1: R137.1 R140.2 R142.1 ; port Thermistor2
NetR138_1: R138.1 R141.2 R143.1 ; port Thermistor3

Not connected (* = marked no-connect by the designer): U17 2(NC)* 7(AIN3)*

### Notes on the sheet
- Sample all three thermistors in 25ms
  Sample rate per channel is 8.33ms (120Hz)
  Set ADC to 920Hz (410Hz Nyquist)
  Filtering is configured for 500Hz
  FSR set to 4.096V
  Address: 0b1001000
- Title
- Size:
- Date:
- A3
- Number:
- Time:
- Revision:
- Sheet
- of
- File:

### Library data of the parts
C96 = CL10B104KA8WPNC: as C70 on sheet ComputeModule; Part Number: CL10B104KA8WPNC; Value: 0.1µF; Applications: Automotive; Capacitance: 0.1µF; ComponentLink1Description: Datasheet; ComponentLink1URL: http://www.samsungsem.com/kr/support/product-search/mlcc/CL10B104KA8WPNC.jsp; ComponentLink2Description: DigiKey Link; ComponentLink2URL: http://digikey.com/product-detail/en/samsung-electro-mechanics/CL10B104KA8WPNC/1276-6717-1-ND/5961576; Device Package: 0603 (1608 Metric); Features: Open Mode; LastUpdated: 9/2/2020 1:03:30 AM; Lifecycle Status: Active; Minimum Order: 1; Mounting Type: Surface Mount, MLCC; Operating Temperature: -55°C ~ 125°C; Package / Case: 0603 (1608 Metric); Packaging: TapeAndReel; PartId: 5631; Part Status: Active; Price: 0.02; Ratings: AEC-Q200; Series: CL; Size / Dimension: 0.063" L x 0.031" W (1.60mm x 0.80mm); Supplier 1: DigiKey; Supplier Part Number 1: 1276-6717-1-ND; Temperature Coefficient: X7R; Thickness (Max): 0.035" (0.90mm); Voltage - Rated: 25V
C97-C99 = C0603C474K4PACTU: CAP CER 0.47UF 16V X5R 0603; Manufacturer: KEMET; Tolerance: ±10%; Part Number: C0603C474K4PACTU; Value: 0.47µF; Applications: General Purpose; Capacitance: 0.47µF; ComponentLink1Description: Datasheet; ComponentLink1URL: https://api.kemet.com/component-edge/download/datasheet/C0603C474K4PACTU.pdf; ComponentLink2Description: DigiKey Link; ComponentLink2URL: http://digikey.com/product-detail/en/kemet/C0603C474K4PACTU/399-7934-1-ND/3471657; Device Package: 0603 (1608 Metric); LastUpdated: 9/2/2020 1:03:36 AM; Lifecycle Status: Active; Minimum Order: 1; Mounting Type: Surface Mount, MLCC; Operating Temperature: -55°C ~ 85°C; Package / Case: 0603 (1608 Metric); Packaging: TapeAndReel; PartId: 2292; Part Status: Active; Price: 0.02; Series: SMD Comm X5R; Size / Dimension: 0.063" L x 0.031" W (1.60mm x 0.80mm); Supplier 1: DigiKey; Supplier Part Number 1: 399-7934-1-ND; Temperature Coefficient: X5R; Thickness (Max): 0.034" (0.87mm); Voltage - Rated: 16V
R136-R138 = RMCF0603FT10K0: RES 10K OHM 1% 1/10W 0603; Manufacturer: Stackpole Electronics Inc; Power (Watts): 0.1W, 1/10W; Temperature Coefficient: ±100ppm/°C; Part Number: RMCF0603FT10K0; Value: 10 kOhms; ComponentLink1Description: Datasheet; ComponentLink1URL: https://www.seielect.com/catalog/sei-rmcf_rmcp.pdf; ComponentLink2Description: DigiKey Link; ComponentLink2URL: http://digikey.com/product-detail/en/stackpole-electronics-inc/RMCF0603FT10K0/RMCF0603FT10K0CT-ND/1943057; Composition: Thick Film; Device Package: 0603 (1608 Metric); Features: Automotive AEC-Q200; Height - Seated (Max): 0.022" (0.55mm); LastUpdated: 9/2/2020 1:09:31 AM; Lifecycle Status: Active; Minimum Order: 1; Number of Terminations: 2; Operating Temperature: -55°C ~ 155°C; Package / Case: 0603 (1608 Metric); Packaging: CutTape; PartId: 25663; Part Status: Active; Price: 0.10; Ratings: AEC-Q200; Resistance: 10 kOhms; Series: RMCF; Size / Dimension: 0.061" L x 0.031" W (1.55mm x 0.80mm); Supplier 1: DigiKey; Supplier Part Number 1: RMCF0603FT10K0CT-ND; Supplier Device Package: 0603; Tolerance: ±1%
R139-R141 = TMP6131DECR: SENSOR PTC 10KOHM 1% X1SON; Manufacturer: Texas Instruments; ComponentLink1Description: Datasheet; ComponentLink1URL: http://www.ti.com/general/docs/suppproductinfo.tsp?distId=10&gotoUrl=http%3A%2F%2Fwww.ti.com%2Flit%2Fgpn%2Ftmp61; ComponentLink2Description: DigiKey Link; ComponentLink2URL: http://digikey.com/product-detail/en/texas-instruments/TMP6131DECR/296-TMP6131DECRCT-ND/10435285; Device Package: 0402 (1006 Metric); LastUpdated: 9/2/2020 1:30:57 AM; Lifecycle Status: Active; Part Number: TMP6131DECR; Minimum Order: 1; Mounting Type: Surface Mount; Operating Temperature: -40°C ~ 125°C (TA); Package / Case: 0402 (1006 Metric); Packaging: TapeAndReel; Part Status: Active; Price: 0.07; Resistance @ 25°C: 10 kOhms; Resistance Tolerance: ±1%; Series: Commercial; Supplier 1: DigiKey; Supplier Part Number 1: 296-TMP6131DECRCT-ND; Supplier Device Package: 2-X1SON (1x.60); Value: 10 kOhms
R142-R144 = RMCF0603FT680R: RES 680 OHM 1% 1/10W 0603; Manufacturer: Stackpole Electronics Inc; Power (Watts): 0.1W, 1/10W; Temperature Coefficient: ±100ppm/°C; Part Number: RMCF0603FT680R; Value: 680 Ohms; ComponentLink1Description: Datasheet; ComponentLink1URL: https://www.seielect.com/catalog/sei-packaging.pdf; ComponentLink2Description: DigiKey Link; ComponentLink2URL: http://digikey.com/product-detail/en/stackpole-electronics-inc/RMCF0603FT680R/RMCF0603FT680RCT-ND/6053170; Composition: Thick Film; Device Package: 0603 (1608 Metric); Features: Automotive AEC-Q200; Height - Seated (Max): 0.022" (0.55mm); LastUpdated: 9/2/2020 1:10:13 AM; Lifecycle Status: Active; Minimum Order: 1; Number of Terminations: 2; Operating Temperature: -55°C ~ 155°C; Package / Case: 0603 (1608 Metric); Packaging: CutTape; PartId: 10671; Part Status: Active; Price: 0.10; Ratings: AEC-Q200; Resistance: 680 Ohms; Series: RMCF; Size / Dimension: 0.061" L x 0.031" W (1.55mm x 0.80mm); Supplier 1: DigiKey; Supplier Part Number 1: RMCF0603FT680RCT-ND; Supplier Device Package: 0603; Tolerance: ±1%
U17 = SCH - DATA ACQUISITION - ADC - TI TLA2024: Supplier 1: Digi-Key